# EAGLE design FAL6567e (EAGLE 7.2.0)
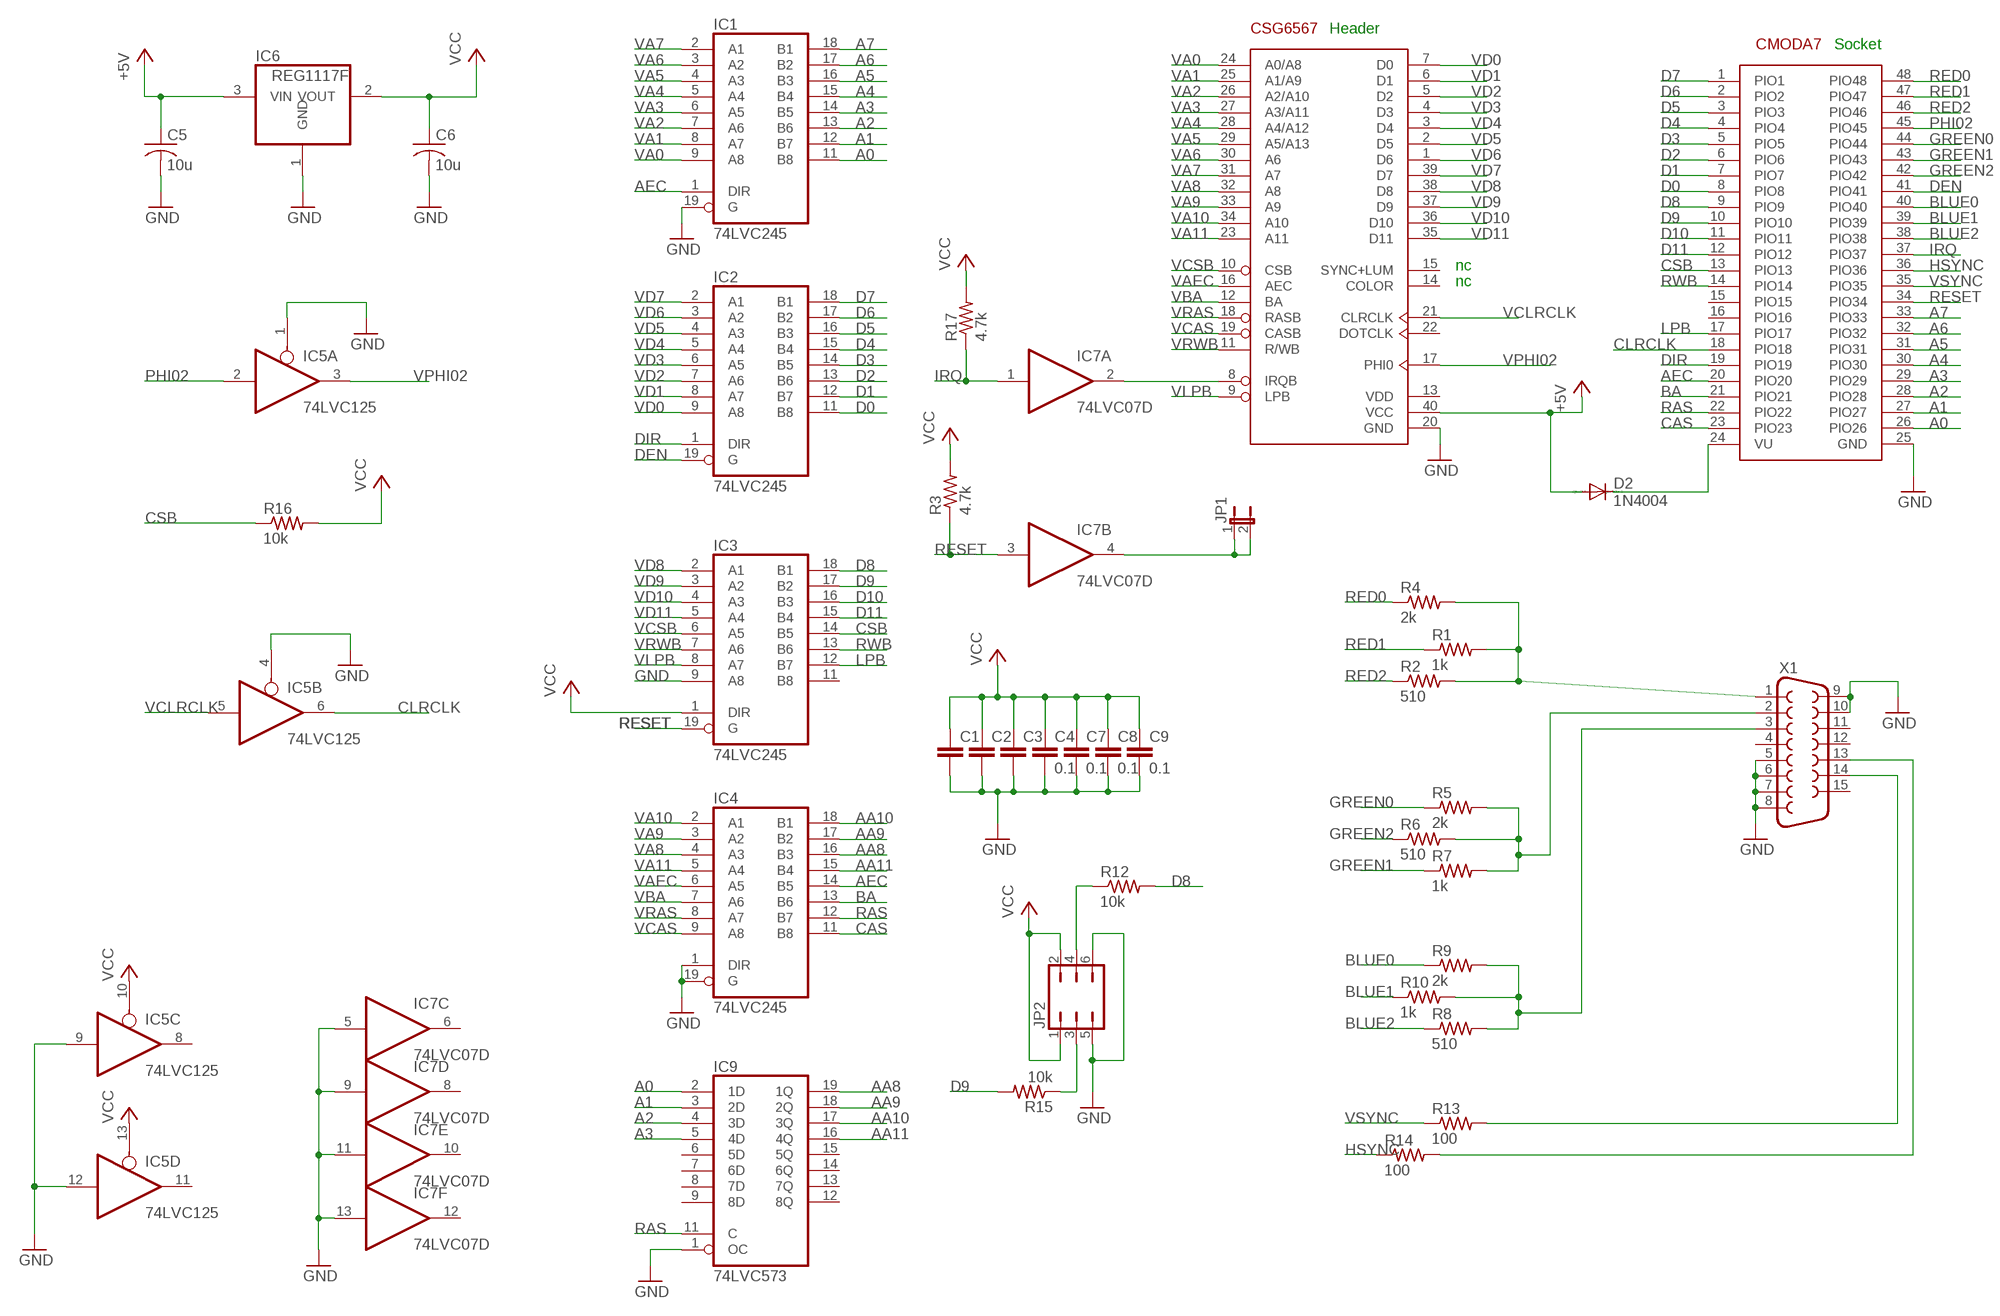
[diagram p0: schematic, sheet 1]

## Parts
C1  C-EU050-024X044  [C050-024X044]
C2  C-EU050-024X044  [C050-024X044]
C3  C-EU050-024X044  [C050-024X044]
C4  0.1  C-EU050-024X044  [C050-024X044]
C5  10u  C-USC1206  [C1206]
C6  10u  C-USC1206  [C1206]
C7  0.1  C-EU050-024X044  [C050-024X044]
C8  0.1  C-EU050-024X044  [C050-024X044]
C9  0.1  C-EU050-024X044  [C050-024X044]
D2  1N4004  [DO41-10]
IC1  74LVC245  74LS245DW  [SO20W]
IC2  74LVC245  74LS245DW  [SO20W]
IC3  74LVC245  74LS245DW  [SO20W]
IC4  74LVC245  74LS245DW  [SO20W]
IC5  74LVC125  [SO14]
IC6  REG1117F  [DD-3]
IC7  74LVC07D  74LS07D  [SO14]
IC9  74LVC573  [SO20W]
JP1  JP1E  [JP1]
JP2  JP3Q  [JP3Q]
R1  1k  R-US_0204/7  [0204/7]
R2  510  R-US_0204/7  [0204/7]
R3  4.7k  R-US_0204/7  [0204/7]
R4  2k  R-US_0204/7  [0204/7]
R5  2k  R-US_0204/7  [0204/7]
R6  510  R-US_0204/7  [0204/7]
R7  1k  R-US_0204/7  [0204/7]
R8  510  R-US_0204/7  [0204/7]
R9  2k  R-US_0204/7  [0204/7]
R10  1k  R-US_0204/7  [0204/7]
R12  10k  R-US_0204/7  [0204/7]
R13  100  R-US_0204/7  [0204/7]
R14  100  R-US_0204/7  [0204/7]
R15  10k  R-US_0204/7  [0204/7]
R16  10k  R-US_0204/7  [0204/7]
R17  4.7k  R-US_0204/7  [0204/7]
U$1  CSG6567  [DIP-40]
U$2  CMODA7  [DIL48]
X1  F15HDV  [HDF15V]

## Nets
+5V: C5.1 D2.A IC6.3(VIN) U$1.40(VCC)
A0: IC1.11(B8) IC9.2(1D) U$2.26(PIO26)
A1: IC1.12(B7) IC9.3(2D) U$2.27(PIO27)
A2: IC1.13(B6) IC9.4(3D) U$2.28(PIO28)
A3: IC1.14(B5) IC9.5(4D) U$2.29(PIO29)
A4: IC1.15(B4) U$2.30(PIO30)
A5: IC1.16(B3) U$2.31(PIO31)
A6: IC1.17(B2) U$2.32(PIO32)
A7: IC1.18(B1) U$2.33(PIO33)
AA8: IC4.16(B3) IC9.19(1Q)
AA9: IC4.17(B2) IC9.18(2Q)
AA10: IC4.18(B1) IC9.17(3Q)
AA11: IC4.15(B4) IC9.16(4Q)
AEC: IC1.1(DIR) IC4.14(B5) U$2.20(PIO20)
BA: IC4.13(B6) U$2.21(PIO21)
BLUE0: R9.1 U$2.40(PIO40)
BLUE1: R10.1 U$2.39(PIO39)
BLUE2: R8.1 U$2.38(PIO38)
CAS: IC4.11(B8) U$2.23(PIO23)
CLRCLK: IC5.6(B:O) U$2.18(PIO18)
CSB: IC3.14(B5) R16.1 U$2.13(PIO13)
D0: IC2.11(B8) U$2.8(PIO8)
D1: IC2.12(B7) U$2.7(PIO7)
D2: IC2.13(B6) U$2.6(PIO6)
D3: IC2.14(B5) U$2.5(PIO5)
D4: IC2.15(B4) U$2.4(PIO4)
D5: IC2.16(B3) U$2.3(PIO3)
D6: IC2.17(B2) U$2.2(PIO2)
D7: IC2.18(B1) U$2.1(PIO1)
D8: IC3.18(B1) R12.2 U$2.9(PIO9)
D9: IC3.17(B2) R15.2 U$2.10(PIO10)
D10: IC3.16(B3) U$2.11(PIO11)
D11: IC3.15(B4) U$2.12(PIO12)
DEN: IC2.19(G) U$2.41(PIO41)
DIR: IC2.1(DIR) U$2.19(PIO19)
GND: C1.2 C2.2 C3.2 C4.2 C5.2 C6.2 C7.2 C8.2 C9.2 IC1.19(G) IC3.9(A8) IC4.1(DIR) IC4.19(G) IC5.1(A:OE) IC5.4(B:OE) IC5.9(C:I) IC5.12(D:I) IC6.1(GND) IC7.5(C:I) IC7.9(D:I) IC7.11(E:I) IC7.13(F:I) IC9.1(OC) JP2.5 JP2.6 U$1.20(GND) U$2.25(GND) X1.5 X1.6 X1.7 X1.8 X1.9 X1.10
GREEN0: R5.1 U$2.44(PIO44)
GREEN1: R7.1 U$2.43(PIO43)
GREEN2: R6.1 U$2.42(PIO42)
HSYNC: R14.1 U$2.36(PIO36)
IRQ: IC7.1(A:I) R17.1 U$2.37(PIO37)
LPB: IC3.12(B7) U$2.17(PIO17)
MD0: JP2.4 R12.1
MD1: JP2.3 R15.1
N$1: IC7.2(A:O) U$1.8(IRQB)
N$4: D2.C U$2.24(VU)
N$7: R1.2 R2.2 R4.2 X1.1
N$8: IC7.4(B:O) JP1.1 JP1.2
N$10: R8.2 R9.2 R10.2 X1.3
N$12: R14.2 X1.13
N$13: R13.2 X1.14
N$15: R5.2 R6.2 R7.2 X1.2
PHI02: IC5.2(A:I) U$2.45(PIO45)
RAS: IC4.12(B7) IC9.11(C) U$2.22(PIO22)
RED0: R4.1 U$2.48(PIO48)
RED1: R1.1 U$2.47(PIO47)
RED2: R2.1 U$2.46(PIO46)
RESET: IC3.19(G) IC7.3(B:I) R3.1 U$2.34(PIO34)
RWB: IC3.13(B6) U$2.14(PIO14)
VA0: IC1.9(A8) U$1.24(A0/A8)
VA1: IC1.8(A7) U$1.25(A1/A9)
VA2: IC1.7(A6) U$1.26(A2/A10)
VA3: IC1.6(A5) U$1.27(A3/A11)
VA4: IC1.5(A4) U$1.28(A4/A12)
VA5: IC1.4(A3) U$1.29(A5/A13)
VA6: IC1.3(A2) U$1.30(A6)
VA7: IC1.2(A1) U$1.31(A7)
VA8: IC4.4(A3) U$1.32(A8)
VA9: IC4.3(A2) U$1.33(A9)
VA10: IC4.2(A1) U$1.34(A10)
VA11: IC4.5(A4) U$1.23(A11)
VAEC: IC4.6(A5) U$1.16(AEC)
VBA: IC4.7(A6) U$1.12(BA)
VCAS: IC4.9(A8) U$1.19(CASB)
VCC: C1.1 C2.1 C3.1 C4.1 C6.1 C7.1 C8.1 C9.1 IC3.1(DIR) IC5.10(C:OE) IC5.13(D:OE) IC6.2(VOUT) JP2.1 JP2.2 R3.2 R16.2 R17.2
VCLRCLK: IC5.5(B:I) U$1.21(CLRCLK)
VCSB: IC3.6(A5) U$1.10(CSB)
VD0: IC2.9(A8) U$1.7(D0)
VD1: IC2.8(A7) U$1.6(D1)
VD2: IC2.7(A6) U$1.5(D2)
VD3: IC2.6(A5) U$1.4(D3)
VD4: IC2.5(A4) U$1.3(D4)
VD5: IC2.4(A3) U$1.2(D5)
VD6: IC2.3(A2) U$1.1(D6)
VD7: IC2.2(A1) U$1.39(D7)
VD8: IC3.2(A1) U$1.38(D8)
VD9: IC3.3(A2) U$1.37(D9)
VD10: IC3.4(A3) U$1.36(D10)
VD11: IC3.5(A4) U$1.35(D11)
VLPB: IC3.8(A7) U$1.9(LPB)
VPHI02: IC5.3(A:O) U$1.17(PHI0)
VRAS: IC4.8(A7) U$1.18(RASB)
VRWB: IC3.7(A6) U$1.11(R/WB)
VSYNC: R13.1 U$2.35(PIO35)
Unconnected: IC3.11(B8) IC5.8(C:O) IC5.11(D:O) IC7.6(C:O) IC7.8(D:O) IC7.10(E:O) IC7.12(F:O) IC9.6(5D) IC9.7(6D) IC9.8(7D) IC9.9(8D) IC9.12(8Q) IC9.13(7Q) IC9.14(6Q) IC9.15(5Q) U$1.14(COLOR) U$1.15(SYNC+LUM) U$1.22(DOTCLK) U$2.15(PIO15) U$2.16(PIO16) X1.4 X1.11 X1.12 X1.15

## Notes on the sheet
- Header
- Socket
- nc
- nc

## Power pins joined to a net without a drawn wire
GND: IC1.10(GND) IC2.10(GND) IC3.10(GND) IC4.10(GND) IC5.7(P:GND) IC7.7(P:GND) IC9.10(GND)
VCC: IC1.20(VCC) IC2.20(VCC) IC3.20(VCC) IC4.20(VCC) IC5.14(P:VCC) IC7.14(P:VCC) IC9.20(VCC)
VDD: U$1.13(VDD)

## Library data of the parts
C1-C4 C7-C9 = resistor:C-EU: CAPACITOR, European symbol
C5 C6 = resistor:C-US: CAPACITOR, American symbol
D2 = diode:1N4004: DIODE general purpose rectifier, 1 A
IC1-IC4 = FT74xx:74*245: Octal BUS TRANSCEIVER, 3-state
IC5 = FT74xx:74*125: Quad bus BUFFER, 3-state
IC6 = burr-brown:REG1117: 800mA and 1A Low Dropout (LDO) Positive Regulator 1.8V, 2.5V, 2.85V, 3.3V, 5V, and Adj; MF: TEXAS INSTRUMENTS; MPN: REG1117FAKTTT; OC_FARNELL: 1296120; OC_NEWARK: 87H2562
IC7 = FT74xx:74*07: Hex BUFFER, open collector high-voltage output
IC9 = FT74xx:74*573: 8-bit D latch BUS DRIVER
JP1 = jumper:JP1E: JUMPER
JP2 = jumper:JP3Q: JUMPER
R1-R10 R12-R17 = resistor:R-US_: RESISTOR, American symbol
U$1 = 65xxx:CSG6567
U$2 = FT74xx:CMODA7
X1 = con-subd:F15: SUB-D; OC_FARNELL: unknown; OC_NEWARK: unknown

## Board
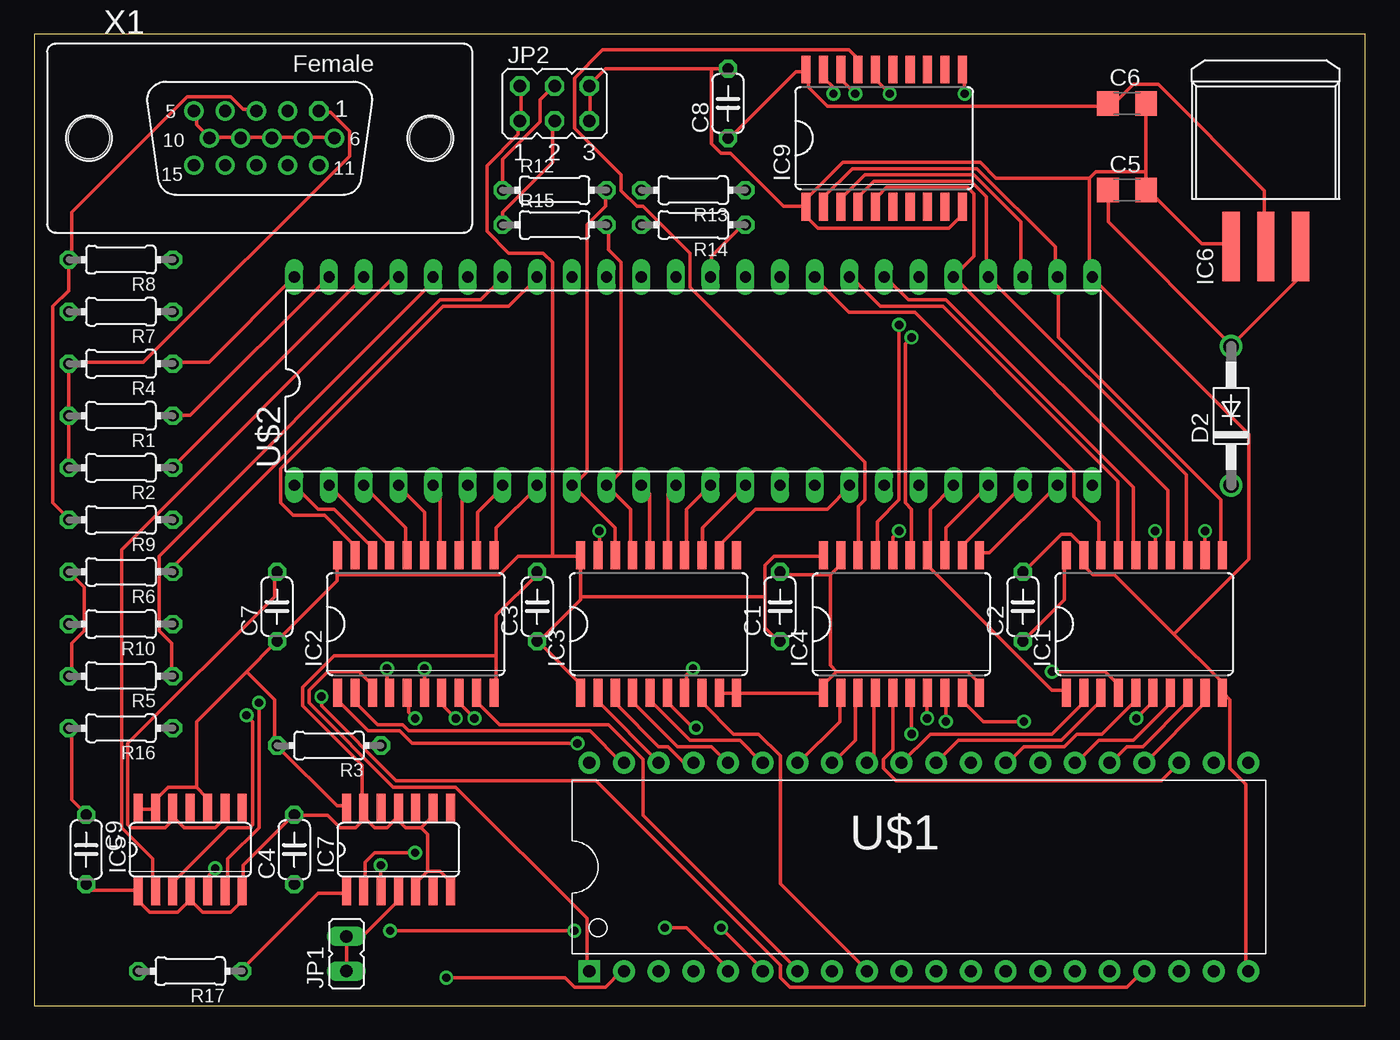
[diagram p1: board, top side]
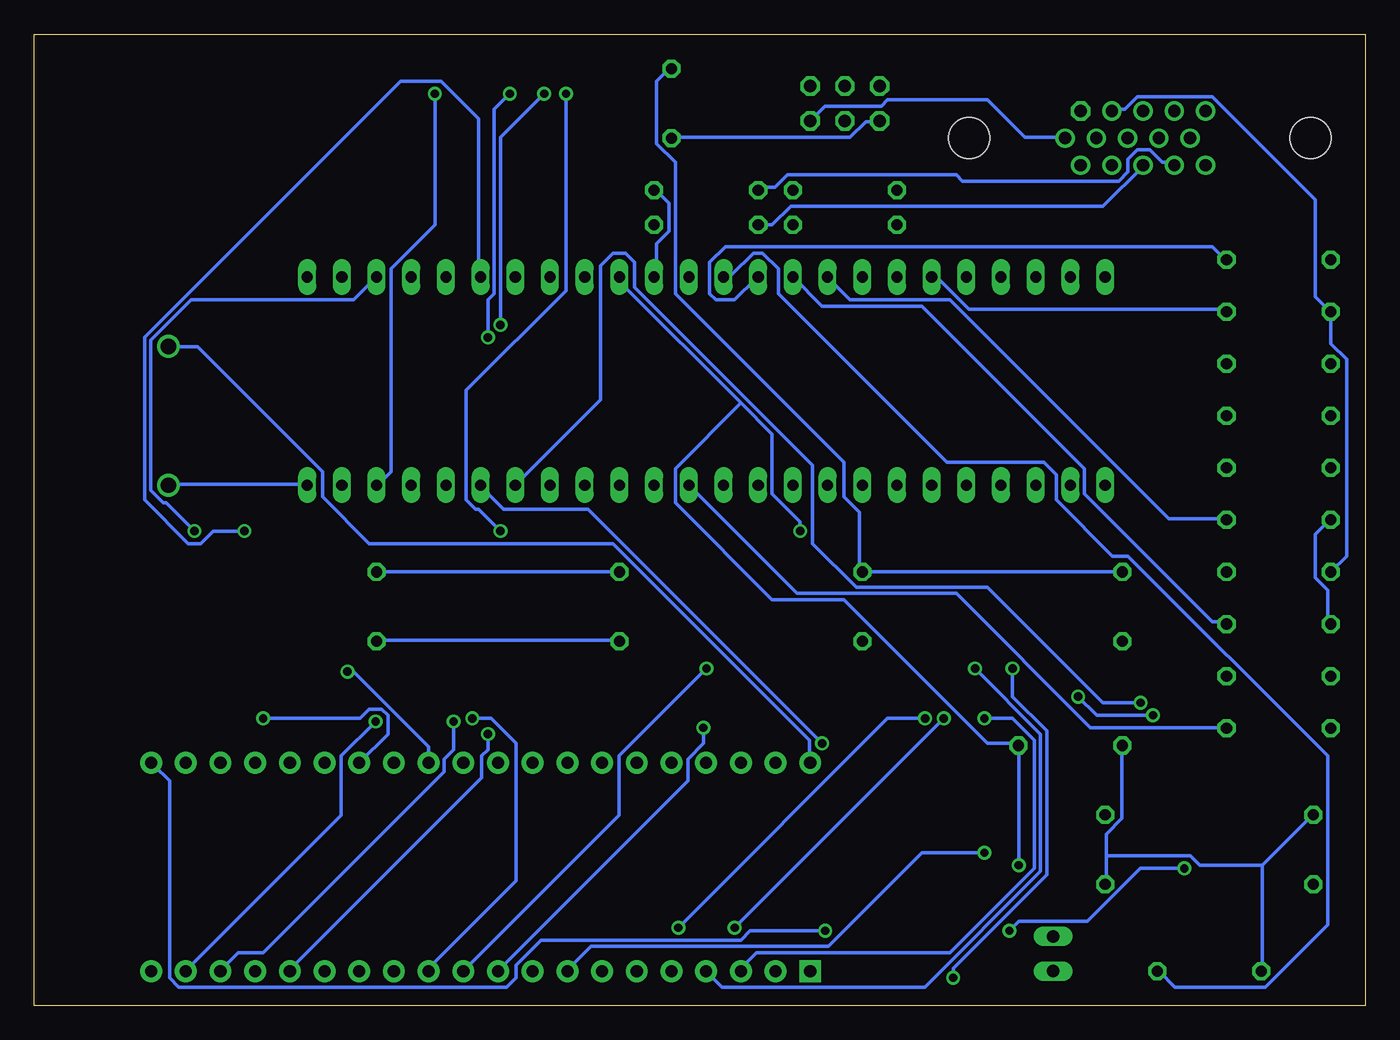
[diagram p2: board, bottom side, seen from below]

Size 97.46 x 71.11 mm. Coordinates in mm from the lower left corner, seen from the top.
Outline: 0,0 97.46,0 97.46,71.11 0,71.11 0,0
Copper layers (1*16): Top 0.035mm / dielectric 1.5mm / Bottom 0.035mm
Design rules "default": minimum track width 10mil, minimum drill 24mil, track to track 8mil, track to pad 8mil, pad to pad 8mil, via to via 8mil, smd to smd 8mil, copper to edge 40mil, drill to drill 8mil, minimum pad ring 10mil, minimum via ring 8mil, stop-mask expansion 4mil, vias tented up to drill 0mil, thermal gap 10mil

### Footprints (pad centres in the part's own frame; a part is rotated, then mirrored left to right if it is on the bottom)
C050-024X044 = drill 0.813 octagon: 1 -2.54,0; 2 2.54,0
C1206 = smd 1.6 x 1.8: 1 -1.4,0; 2 1.4,0
DO41-10 = drill 1.118: A 5.08,0; C -5.08,0
SO20W = smd 0.66 x 2.032: 1 -5.715,-5.029; 2 -4.445,-5.029; 3 -3.175,-5.029; 4 -1.905,-5.029; 5 -0.635,-5.029; 6 0.635,-5.029; 7 1.905,-5.029; 8 3.175,-5.029; 9 4.445,-5.029; 10 5.715,-5.029; 11 5.715,5.029; 12 4.445,5.029; 13 3.175,5.029; 14 1.905,5.029; 15 0.635,5.029; 16 -0.635,5.029; 17 -1.905,5.029; 18 -3.175,5.029; 19 -4.445,5.029; 20 -5.715,5.029
SO14 = smd 0.66 x 2.032: 1 -3.81,-3.073; 2 -2.54,-3.073; 3 -1.27,-3.073; 4 0,-3.073; 5 1.27,-3.073; 6 2.54,-3.073; 7 3.81,-3.073; 8 3.81,3.073; 9 2.54,3.073; 10 1.27,3.073; 11 0,3.073; 12 -1.27,3.073; 13 -2.54,3.073; 14 -3.81,3.073
DD-3 = smd 1.27 x 5.08: 1 -2.54,-7.938; 2 0,-7.938; 3 2.54,-7.938
JP1 = drill 0.914 long: 1 0,-1.27; 2 0,1.27
JP3Q = drill 0.914 octagon: 1 -2.54,-1.27; 2 -2.54,1.27; 3 0,-1.27; 4 0,1.27; 5 2.54,-1.27; 6 2.54,1.27
0204/7 = drill 0.813 octagon: 1 -3.81,0; 2 3.81,0
DIP-40 = drill 0.889 pad 1.6 square: 1 -22.86,-7.62 | drill 0.889 pad 1.6: 2 -20.32,-7.62; 3 -17.78,-7.62; 4 -15.24,-7.62; 5 -12.7,-7.62; 6 -10.16,-7.62; 7 -7.62,-7.62; 8 -5.08,-7.62; 9 -2.54,-7.62; 10 0,-7.62; 11 2.54,-7.62; 12 5.08,-7.62; 13 7.62,-7.62; 14 10.16,-7.62; 15 12.7,-7.62; 16 15.24,-7.62; 17 17.78,-7.62; 18 20.32,-7.62; 19 22.86,-7.62; 20 25.4,-7.62; 21 25.4,7.62; 22 22.86,7.62; 23 20.32,7.62; 24 17.78,7.62; 25 15.24,7.62; 26 12.7,7.62; 27 10.16,7.62; 28 7.62,7.62; 29 5.08,7.62; 30 2.54,7.62; 31 0,7.62; 32 -2.54,7.62; 33 -5.08,7.62; 34 -7.62,7.62; 35 -10.16,7.62; 36 -12.7,7.62; 37 -15.24,7.62; 38 -17.78,7.62; 39 -20.32,7.62; 40 -22.86,7.62
DIL48 = drill 0.813 long: 1 -29.21,-7.62; 2 -26.67,-7.62; 3 -24.13,-7.62; 4 -21.59,-7.62; 5 -19.05,-7.62; 6 -16.51,-7.62; 7 -13.97,-7.62; 8 -11.43,-7.62; 9 -8.89,-7.62; 10 -6.35,-7.62; 11 -3.81,-7.62; 12 -1.27,-7.62; 13 1.27,-7.62; 14 3.81,-7.62; 15 6.35,-7.62; 16 8.89,-7.62; 17 11.43,-7.62; 18 13.97,-7.62; 19 16.51,-7.62; 20 19.05,-7.62; 21 21.59,-7.62; 22 24.13,-7.62; 23 26.67,-7.62; 24 29.21,-7.62; 25 29.21,7.62; 26 26.67,7.62; 27 24.13,7.62; 28 21.59,7.62; 29 19.05,7.62; 30 16.51,7.62; 31 13.97,7.62; 32 11.43,7.62; 33 8.89,7.62; 34 6.35,7.62; 35 3.81,7.62; 36 1.27,7.62; 37 -1.27,7.62; 38 -3.81,7.62; 39 -6.35,7.62; 40 -8.89,7.62; 41 -11.43,7.62; 42 -13.97,7.62; 43 -16.51,7.62; 44 -19.05,7.62; 45 -21.59,7.62; 46 -24.13,7.62; 47 -26.67,7.62; 48 -29.21,7.62
HDF15V = drill 0.9 octagon: 1 4.329,1.98 | drill 0.9: 2 2.043,1.98; 3 -0.243,1.98; 4 -2.529,1.98; 5 -4.815,1.98; 6 5.472,0; 7 3.186,0; 8 0.9,0; 9 -1.386,0; 10 -3.672,0; 11 4.329,-1.98; 12 2.043,-1.98; 13 -0.243,-1.98; 14 -2.529,-1.98; 15 -4.815,-1.98 | hole 3: -12.5,0; 12.5,0

### Placement (x,y rotation side)
C1  54.61,29.21 90 top
C2  72.39,29.21 90 top
C3  36.83,29.21 90 top
C4  19.05,11.43 90 top
C5  80.01,59.69 0 top
C6  80.01,66.04 0 top
C7  17.78,29.21 90 top
C8  50.8,66.04 90 top
C9  3.81,11.43 270 top
D2  87.63,43.18 90 top
IC1  81.28,27.94 0 top
IC2  27.94,27.94 0 top
IC3  45.72,27.94 0 top
IC4  63.5,27.94 0 top
IC5  11.43,11.43 0 top
IC6  90.17,63.5 0 top
IC7  26.67,11.43 0 top
IC9  62.23,63.5 0 top
JP1  22.86,3.81 0 top
JP2  38.1,66.04 0 top
R1  6.35,43.18 180 top
R2  6.35,39.37 180 top
R3  21.59,19.05 180 top
R4  6.35,46.99 180 top
R5  6.35,24.13 180 top
R6  6.35,31.75 180 top
R7  6.35,50.8 180 top
R8  6.35,54.61 180 top
R9  6.35,35.56 180 top
R10  6.35,27.94 180 top
R12  38.1,59.69 0 top
R13  48.26,59.69 180 top
R14  48.26,57.15 180 top
R15  38.1,57.15 0 top
R16  6.35,20.32 180 top
R17  11.43,2.54 180 top
U$1  63.5,10.16 0 top
U$2  48.26,45.72 0 top
X1  16.51,63.5 0 top

### Tracks (layer width: path | path; a pad name or v marks a point on that pad's centre or on a via)
+5V
  Top 0.254: C5.1 78.64,59.66 78.64,57.38 87.55,48.46 D2.A 87.78,48.46 92.58,53.26 92.58,55.55 IC6.3
  Bottom 0.254: U$1.40 40.69,17.83 40.69,19.43 55.09,33.83 72.92,33.83 76.35,37.26 76.35,39.09 85.5,48.23 87.55,48.23 D2.A
A0
  Top 0.254: IC9.2 57.84,58.52 57.84,59.21 59.89,61.27 69.04,61.27 74.75,55.55 74.75,53.49 U$2.26 74.98,53.26 74.98,48.92 86.87,37.03 86.87,33.15 IC1.11
A1  (via drill 0.61)
  Top 0.254: v85.72,34.75 IC1.12 | IC9.3 59.21,58.52 59.21,59.21 60.81,60.81 68.81,60.81 72.24,57.38 72.24,53.49 U$2.27
  Bottom 0.254: v85.72,34.75 87.78,36.8 88.01,36.8 88.92,37.72 88.92,48.69 85.95,51.66 74.07,51.66 U$2.27
A2
  Top 0.254: IC1.13 84.35,33.15 84.35,38.86 69.95,53.26 U$2.28 69.72,53.49 69.72,59.21 68.58,60.35 61.49,60.35 60.35,59.21 60.35,58.52 IC9.4
A3
  Top 0.254: IC9.5 61.72,58.52 61.72,59.21 62.41,59.89 68.35,59.89 68.81,59.44 68.81,54.86 67.44,53.49 U$2.29 67.44,53.26 82.98,37.72 82.98,33.15 IC1.14
A4  (via drill 0.61)
  Top 0.254: v82.07,34.75 82.07,33.15 IC1.15
  Bottom 0.254: v82.07,34.75 84.35,34.75 85.27,33.83 86.18,33.83 89.38,37.03 89.38,48.92 70.64,67.67 67.67,67.67 64.92,64.92 64.92,53.49 U$2.30
A5
  Top 0.254: IC1.16 80.47,33.15 80.47,37.95 66.75,51.66 64.01,51.66 62.41,53.26 U$2.31
A6
  Top 0.254: IC1.17 79.32,33.15 79.32,38.41 66.52,51.21 61.95,51.21 59.89,53.26 U$2.32
A7
  Top 0.254: IC1.18 77.95,33.15 77.95,35.43 76.12,37.26 76.12,39.09 64.47,50.75 59.66,50.75 57.15,53.26 U$2.33
AA8  (via drill 0.61)
  Top 0.254: IC4.16 62.87,34.29 v63.32,34.75 | v58.52,66.75 58.52,67.21 57.84,67.89 57.84,68.35 IC9.19
  Bottom 0.254: v63.32,34.75 64.92,36.35 65.15,36.35 65.84,37.03 65.84,45.03 58.52,52.35 v58.52,66.75
AA9  (via drill 0.61)
  Top 0.254: v63.32,49.84 63.32,37.03 61.72,35.43 61.72,33.15 IC4.17 | v60.12,66.75 59.21,67.67 59.21,68.35 IC9.18
  Bottom 0.254: v63.32,49.84 63.32,63.55 v60.12,66.75
AA10
  Top 0.254: IC4.18 60.35,33.15 60.35,36.58 60.81,37.03 60.81,39.78 48.01,52.58 48.01,55.09 44.58,58.52 44.12,58.52 42.98,59.66 42.98,60.81 39.55,64.24 39.55,67.89 41.6,69.95 59.66,69.95 60.12,69.49 60.12,68.58 IC9.17
AA11  (via drill 0.61)
  Top 0.254: v64.24,48.92 63.78,48.46 63.78,36.8 64.24,36.35 64.24,33.15 IC4.15 | v62.64,66.75 61.72,67.67 61.72,68.35 IC9.16
  Bottom 0.254: v64.24,48.92 64.24,51.66 63.78,52.12 63.78,65.61 v62.64,66.75
AEC
  Top 0.254: U$2.20 67.21,37.95 65.61,36.35 65.61,33.15 IC4.14 65.61,32.92 65.61,32 74.52,23.09 75.44,23.09 IC1.1
BA
  Top 0.254: IC4.13 66.75,33.15 66.75,34.98 69.72,37.95 U$2.21
BLUE0
  Bottom 0.254: R9.1 10.29,35.66 14.4,35.66 30.4,51.66 37.72,51.66 39.32,53.26 U$2.40
BLUE1
  Bottom 0.254: U$2.39 39.78,51.21 32.46,51.21 20.57,39.32 20.57,37.49 11.2,28.12 10.29,28.12 R10.1
BLUE2
  Bottom 0.254: U$2.38 44.58,53.26 46.18,51.66 47.55,51.66 48.01,52.12 48.01,54.41 46.86,55.55 11.2,55.55 10.29,54.63 R8.1
CAS
  Top 0.254: IC4.11 69.27,33.15 69.95,33.15 74.75,37.95 U$2.23
CLRCLK  (via drill 0.61)
  Top 0.254: v16.46,22.17 16.46,13.03 14.17,10.74 14.17,8.46 IC5.6
  Bottom 0.254: v16.46,22.17 19.2,22.17 27.66,30.63 37.26,30.63 40.46,33.83 40.46,39.55 53.49,52.58 53.49,54.41 54.18,55.09 55.09,55.09 56.01,54.18 56.01,44.35 62.18,38.18 U$2.18
CSB
  Top 0.254: U$2.13 47.78,36.35 47.78,33.15 IC3.14
  Bottom 0.254: U$2.13 41.6,30.18 29.95,30.18 20.12,20.34 10.29,20.34 R16.1
D0
  Top 0.254: IC2.11 33.83,33.15 33.83,34.98 36.8,37.95 U$2.8
D1
  Top 0.254: IC2.12 32.46,33.15 32.46,36.12 34.29,37.95 U$2.7
D2
  Top 0.254: IC2.13 31.32,33.15 31.32,37.72 31.55,37.95 U$2.6
D3
  Top 0.254: IC2.14 29.72,33.15 29.72,37.49 29.26,37.95 U$2.5
D4
  Top 0.254: IC2.15 28.57,36.12 26.75,37.95 U$2.4
D5
  Top 0.254: IC2.16 27.2,33.15 27.2,34.98 24.23,37.95 U$2.3
D6
  Top 0.254: IC2.17 25.83,33.15 25.83,33.83 21.72,37.95 U$2.2
D7
  Top 0.254: U$2.1 20.8,36.35 21.95,36.35 24.69,33.6 24.69,33.15 IC2.18
D8
  Top 0.254: IC3.18 42.52,33.15 42.52,34.98 39.55,37.95 U$2.9 39.55,38.18 40.46,39.09 40.46,57.15 41.83,58.52 41.83,59.66 R12.2
D9
  Top 0.254: IC3.17 43.66,33.15 43.66,36.35 U$2.10 42.06,38.18 42.98,39.09 42.98,54.41 42.06,55.32 42.06,57.15 R15.2
D10
  Top 0.254: IC3.16 45.03,33.15 45.03,37.49 44.58,37.95 U$2.11
D11
  Top 0.254: IC3.15 46.41,33.15 46.41,37.49 46.86,37.95 U$2.12
DEN
  Top 0.254: IC2.19 23.32,33.15 23.32,33.83 21.26,35.89 18.97,35.89 18.06,36.8 18.06,39.32 29.95,51.21 34.75,51.21 36.8,53.26 U$2.41
DIR  (via drill 0.61)
  Top 0.254: v39.78,19.2 27.66,19.2 26.75,20.12 24.46,20.12 22.4,22.17 22.4,22.86 IC2.1
  Bottom 0.254: v39.78,19.2 56.92,36.35 63.09,36.35 64.69,37.95 U$2.19
GND
  Top 0.254: 58.29,31.55 58.98,32.23 58.98,32.92 IC4.19 | 58.29,31.55 54.63,31.55 C1.2 | 51.44,22.86 50.29,22.86 IC3.9 | 51.44,22.86 57.61,22.86 IC4.1 57.84,23.09 57.84,23.55 58.75,24.46 | 51.44,22.86 IC3.10 | 58.75,24.46 68.35,24.46 69.04,23.77 69.04,23.09 IC4.10 | 58.29,31.55 58.29,24.92 58.75,24.46 | C2.2 72.47,31.77 75.21,34.52 75.89,34.52 76.81,33.6 76.81,33.15 IC1.19 77.04,32.92 77.04,32 77.5,31.55 79.1,31.55 83.44,27.2 | 83.44,27.2 86.87,23.77 86.87,23.09 IC1.10 87.1,22.86 87.55,22.4 87.55,17.37 88.7,16.23 88.7,2.74 U$1.20 | C9.2 3.89,8.69 4.12,8.46 7.54,8.46 IC5.1 7.77,8.23 7.77,7.54 8.46,6.86 10.52,6.86 11.43,7.77 | 11.43,7.77 IC5.4 11.43,8.23 | 11.43,7.77 12.34,6.86 14.4,6.86 15.09,7.54 15.09,8.23 IC5.7 15.32,8.46 15.32,10.29 18.97,13.95 C4.2 19.2,13.95 21.49,13.95 22.4,13.03 23.55,13.03 24.23,13.72 | 28.8,9.83 28.12,9.14 28.12,8.46 IC7.5 | 28.8,9.83 29.72,9.83 30.4,9.14 30.4,8.46 IC7.7 | 24.23,13.72 24.23,14.4 IC7.13 | 24.23,13.72 24.92,13.03 25.83,13.03 26.52,13.72 | 26.52,13.72 26.52,14.4 IC7.11 26.52,13.72 | 28.35,13.03 29.03,13.72 29.03,14.4 IC7.9 | 28.35,13.03 27.2,13.03 26.52,13.72 | 24.23,13.72 IC7.13 | 28.8,9.83 28.8,12.57 28.35,13.03 | 10.29,13.72 10.29,14.4 IC5.12 10.29,13.72 | 10.29,13.72 10.97,13.03 13.26,13.03 13.95,13.72 13.95,14.4 IC5.9 | 33.83,25.6 33.83,28.57 36.8,31.55 C3.2 | 33.83,25.6 33.83,23.09 IC2.10 | 10.29,13.72 9.6,13.03 7.09,13.03 6.86,13.26 6.86,19.2 17.6,29.95 17.6,31.55 C7.2 | 33.83,25.6 21.95,25.6 19.66,23.32 19.66,21.95 24,17.6 24,14.63 IC7.13 | 81.38,61.04 81.38,65.84 C6.2 | 81.38,61.04 81.38,59.89 C5.2 81.61,59.66 85.5,55.78 87.55,55.78 IC6.1
  Top 0.254: 77.27,60.58 77.27,53.49 U$2.25 77.5,53.26 88.92,41.83 88.92,32.69 83.44,27.2 | 77.27,60.58 77.72,61.04 81.38,61.04 | X1.6 21.95,63.55 19.89,63.55 X1.7 19.66,63.55 17.6,63.55 X1.8 17.37,63.55 15.32,63.55 X1.9 15.09,63.55 13.03,63.55 X1.10 12.8,63.55 11.89,64.47 11.89,65.38 X1.5 | IC9.1 56.69,58.29 56.69,57.61 57.38,56.92 66.98,56.92 67.89,57.84 67.89,58.29 IC9.10 | 49.61,68.58 41.83,68.58 40.69,67.44 JP2.6 40.69,67.21 40.69,64.92 JP2.5 | 49.61,68.58 C8.2 | 49.61,68.58 49.61,63.09 50.29,62.41 50.98,62.41 54.86,58.52 56.46,58.52 IC9.1 | 77.27,60.58 70.41,60.58 69.27,61.72 59.21,61.72 56.69,59.21 56.69,58.52 IC9.1
  Bottom 0.254: C1.2 54.63,31.77 72.24,31.77 C2.2 | C7.2 17.83,31.77 36.8,31.77 C3.2 37.03,31.77 37.03,36.12 38.18,37.26 38.18,39.78 50.52,52.12 50.52,61.72 51.89,63.09 51.89,67.67 50.98,68.58 C8.2 | X1.6 22.17,63.55 24.92,63.55 27.66,66.29 34.98,66.29 35.43,65.84 39.55,65.84 40.46,64.92 JP2.5
GREEN0
  Top 0.254: R5.1 10.06,24.23 10.06,26.52 9.14,27.43 9.14,32.92 29.03,52.81 29.03,53.26 U$2.44
GREEN1
  Bottom 0.254: R7.1 10.29,50.98 29.03,50.98 31.55,53.49 U$2.43
GREEN2
  Top 0.254: R6.1 10.29,31.77 10.29,32.23 29.72,51.66 32.69,51.66 34.29,53.26 U$2.42
HSYNC
  Top 0.254: U$2.36 49.61,53.49 49.61,54.86 51.89,57.15 R14.1
IRQ
  Top 0.254: IC7.1 22.86,8.23 20.8,8.23 15.32,2.74 R17.1
  Bottom 0.254: U$2.37 46.86,53.49 46.41,53.49 44.81,55.09 44.12,55.09 42.98,53.95 42.98,52.12 30.63,39.78 23.55,39.78 22.63,38.86 22.63,37.03 18.52,32.92 17.37,32.92 2.74,18.29 2.74,5.94 7.32,1.37 13.95,1.37 15.09,2.52 R17.1
LPB
  Top 0.254: IC3.12 50.29,33.15 50.29,33.83 52.81,36.35 58.06,36.35 59.66,37.95 U$2.17
MD0
  Top 0.254: R12.1 34.29,61.95 37.03,64.69 37.03,66.29 37.95,67.21 JP2.4
MD1
  Top 0.254: R15.1 34.29,58.06 37.95,61.72 37.95,64.69 JP2.3
N$1  (via drill 0.61)
  Top 0.254: v27.89,11.2 24.92,11.2 24.23,10.52 24.23,8.46 IC7.2
  Bottom 0.254: v27.89,11.2 32.46,11.2 39.32,4.34 56.69,4.34 58.29,2.74 U$1.8
N$4
  Bottom 0.254: U$2.24 77.5,38.18 87.55,38.18 D2.C
N$7
  Top 0.254: R2.2 2.52,39.55 2.52,42.98 R1.2 2.52,43.2 2.52,46.86 R4.2 2.74,47.09 8,47.09 23.09,62.18 23.09,64.01 21.72,65.38 21.03,65.38 X1.1
N$8
  Top 0.254: IC7.4 26.52,8.23 26.52,7.54 24.23,5.26 22.86,5.26 JP1.2 JP1.1
N$10
  Top 0.254: R9.2 2.52,35.66 1.37,36.8 1.37,51.21 2.52,52.35 2.52,54.41 R8.2 2.74,54.63 2.74,58.06 11.2,66.52 14.4,66.52 15.32,65.61 16.23,65.61 X1.3
  Bottom 0.254: R10.2 2.74,28.12 2.74,30.4 3.66,31.32 3.66,34.52 2.74,35.43 R9.2
N$12
  Bottom 0.254: R14.2 43.43,57.15 42.06,58.52 19.2,58.52 16.23,61.49 X1.13
N$13
  Bottom 0.254: R13.2 44.35,59.89 43.2,59.89 42.29,60.81 29.95,60.81 29.49,60.35 18.06,60.35 17.37,61.04 17.37,61.95 16.69,62.64 15.77,62.64 14.86,61.72 14.17,61.72 X1.14
N$15
  Top 0.254: R6.2 3.66,30.63 3.66,27.43 2.74,26.52 2.74,24.23 R5.2
  Bottom 0.254: R6.2 1.37,32.92 1.37,47.32 2.52,48.46 2.52,50.75 R7.2 2.74,50.98 3.66,51.89 3.66,58.98 11.2,66.52 16.69,66.52 17.6,65.61 18.52,65.61 X1.2
PHI02
  Top 0.254: IC5.2 8.69,8.46 8.69,10.74 6.4,13.03 6.4,33.38 26.52,53.49 U$2.45
RAS  (via drill 0.61)
  Top 0.254: U$2.22 68.12,33.83 68.12,33.15 IC4.12 | v68.12,66.75 68.12,68.35 IC9.11
  Bottom 0.254: v68.12,66.75 68.12,57.15 71.32,53.95 71.32,39.09 72.24,38.18 U$2.22
RED0
  Top 0.254: U$2.48 12.8,47.09 10.29,47.09 R4.1
RED1
  Top 0.254: R1.1 10.29,43.2 11.43,43.2 21.49,53.26 U$2.47
RED2
  Top 0.254: R2.1 10.29,39.55 24,53.26 U$2.46
RESET  (via drill 0.61)
  Top 0.254: v25.38,10.29 25.38,8.46 IC7.3 | v41.38,34.75 41.38,33.15 IC3.19
  Bottom 0.254: v25.38,10.29 25.38,18.97 R3.1 25.6,19.2 27.66,19.2 38.18,29.72 43.43,29.72 50.52,36.8 50.52,39.32 45.72,44.12 | v41.38,34.75 41.38,35.43 43.43,37.49 43.43,41.83 45.72,44.12 | 45.72,44.12 54.41,52.81 54.41,53.26 U$2.34
RWB
  Top 0.254: IC3.13 48.92,33.15 48.92,34.98 51.89,37.95 U$2.14
VA0
  Top 0.254: IC1.9 85.72,22.17 81.38,17.83 U$1.24
VA1
  Top 0.254: IC1.8 84.35,22.86 84.35,22.17 81.15,18.97 80.01,18.97 78.87,17.83 U$1.25
VA2
  Top 0.254: IC1.7 82.98,22.86 82.98,21.95 80.47,19.43 77.95,19.43 76.35,17.83 U$1.26
VA3  (via drill 0.61)
  Top 0.254: v80.7,21.03 81.84,22.17 81.84,22.86 IC1.6
  Bottom 0.254: v80.7,21.03 73.61,21.03 72.92,21.72 72.01,21.72 71.55,21.26 71.55,19.89 U$1.27
VA4
  Top 0.254: IC1.5 80.47,22.86 80.47,22.17 78.18,19.89 76.35,19.89 75.44,18.97 72.47,18.97 71.32,17.83 U$1.28
VA5  (via drill 0.61)
  Top 0.254: v74.52,24.46 78.41,24.46 79.32,23.55 79.32,23.09 IC1.4
  Bottom 0.254: v74.52,24.46 74.07,24.46 68.58,18.97 U$1.29
VA6
  Top 0.254: IC1.3 77.95,22.86 77.95,22.17 75.21,19.43 67.67,19.43 66.06,17.83 U$1.30
VA7
  Top 0.254: U$1.31 65.61,19.89 74.52,19.89 76.81,22.17 76.81,22.86 IC1.2
VA8
  Top 0.254: IC4.4 61.49,22.86 61.49,18.29 61.04,17.83 U$1.32
VA9
  Top 0.254: IC4.3 60.12,22.86 60.12,19.43 58.52,17.83 U$1.33
VA10
  Top 0.254: IC4.2 58.98,22.86 58.98,20.8 56.01,17.83 U$1.34
VA11
  Top 0.254: IC4.5 62.87,18.75 62.18,18.06 62.18,17.37 63.09,16.46 82.53,16.46 83.67,17.6 U$1.23
VAEC  (via drill 0.61)
  Top 0.254: v64.24,19.89 64.24,22.86 IC4.6
  Bottom 0.254: v64.24,19.89 64.24,18.75 64.69,18.29 64.69,16.69 78.64,2.74 U$1.16
VBA  (via drill 0.61)
  Top 0.254: v65.38,21.03 65.38,22.86 IC4.7
  Bottom 0.254: v65.38,21.03 64.01,21.03 62.18,19.2 62.18,9.14 68.58,2.74 U$1.12
VCAS  (via drill 0.61)
  Top 0.254: v72.47,20.8 69.49,20.8 68.12,22.17 68.12,22.86 IC4.9
  Bottom 0.254: v72.47,20.8 74.98,18.29 74.98,13.95 86.18,2.74 U$1.19
VCC
  Top 0.254: IC6.2 90.07,55.78 90.07,59.66 82.3,67.44 80.47,67.44 79.1,66.06 78.64,66.06 C6.1 78.41,65.84 58.06,65.84 56.69,67.21 56.69,68.35 IC9.20 56.46,68.35 55.78,68.35 50.98,63.55 C8.1 | JP2.2 35.66,67.21 35.66,64.92 JP2.1 35.43,64.69 35.43,63.78 33.15,61.49 33.15,56.69 34.75,55.09 37.26,55.09 37.95,54.41 37.95,32.92 | C2.1 75.44,29.72 75.44,32.92 IC1.20 | 53.49,29.95 53.49,27.66 54.41,26.75 C1.1 | 53.49,29.95 53.49,32.23 54.18,32.92 57.61,32.92 IC4.20 | IC3.1 40.01,23.55 37.03,26.52 C3.1 37.03,26.75 40.01,29.72 40.01,29.95 | 40.01,29.95 40.01,32.92 | 40.01,29.95 53.49,29.95 | R16.2 2.74,20.12 2.74,15.09 3.66,14.17 C9.1 | IC7.14 22.86,14.63 22.17,14.63 17.83,18.97 R3.2 17.6,19.2 17.6,22.4 15.54,24.46 | IC5.14 7.77,14.4 8.69,14.4 IC5.13 8.91,14.63 8.91,15.09 9.83,16 11.89,16 | 11.89,16 12.57,15.32 12.57,14.63 IC5.10 | 22.17,31.55 22.17,31.09 17.83,26.75 C7.1 17.6,26.52 15.54,24.46 | 22.17,31.55 22.17,32.92 IC2.20 | 11.89,16 11.89,20.8 15.54,24.46 | 37.95,32.92 35.43,32.92 34.06,31.55 22.17,31.55 | 37.95,32.92 40.01,32.92 | 40.01,32.92 IC3.20
  Bottom 0.254: JP2.1 35.66,64.69 36.58,64.69 37.72,63.55 50.75,63.55 C8.1 | C2.1 72.24,26.75 54.63,26.75 C1.1 | 7.54,10.29 7.54,2.74 R17.2 | 7.54,10.29 3.89,13.95 C9.1 | 18.97,10.97 18.97,12.57 17.83,13.72 17.83,18.97 R3.2 | 18.97,10.97 18.97,8.91 C4.1 | 7.54,10.29 12.12,10.29 12.8,10.97 18.97,10.97
VCLRCLK  (via drill 0.61)
  Top 0.254: v13.26,10.06 12.8,9.6 12.8,8.46 IC5.5 | v39.55,5.49 v26.06,5.49
  Bottom 0.254: v13.26,10.06 16.46,10.06 20.34,6.17 25.38,6.17 v26.06,5.49 | v39.55,5.49 45.03,5.49 45.72,4.8 60.35,4.8 62.18,2.97 62.18,2.06 62.87,1.37 86.87,1.37 87.55,2.06 87.55,16.46 88.7,17.6 U$1.21
VCSB  (via drill 0.61)
  Top 0.254: v48.46,20.34 48.23,20.34 46.41,22.17 46.41,22.86 IC3.6
  Bottom 0.254: v48.46,20.34 48.46,19.2 49.61,18.06 49.61,16.46 63.32,2.74 U$1.10
VD0
  Top 0.254: IC2.9 32.46,22.86 32.46,22.17 34.06,20.57 42.06,20.57 44.58,18.06 44.58,13.95 55.78,2.74 U$1.7
VD1  (via drill 0.61)
  Top 0.254: v32.23,21.03 31.32,21.95 31.32,22.86 IC2.8 | v50.29,5.71 53.26,2.74 U$1.6
  Bottom 0.254: v32.23,21.03 34.98,21.03 v50.29,5.71
VD2  (via drill 0.61)
  Top 0.254: v30.86,21.03 29.95,21.95 29.95,22.86 IC2.7 | v46.18,5.71 47.78,5.71 50.75,2.74 U$1.5
  Bottom 0.254: v46.18,5.71 v30.86,21.03
VD3  (via drill 0.61)
  Top 0.254: v28.57,24.69 IC2.6
  Bottom 0.254: v28.57,24.69 23.77,19.89 23.77,9.83 32.23,1.37 47.09,1.37 U$1.4
VD4  (via drill 0.61)
  Top 0.254: v27.89,21.03 27.43,21.49 27.43,22.86 IC2.5
  Bottom 0.254: v27.89,21.03 25.83,21.03 24.23,19.43 24.23,10.06 30.4,3.89 44.58,3.89 45.72,2.74 U$1.3
VD5  (via drill 0.61)
  Top 0.254: v25.83,24.69 25.83,23.09 IC2.4 | v30.18,2.06 38.86,2.06 39.55,1.37 41.83,1.37 42.98,2.52 U$1.2
  Bottom 0.254: v25.83,24.69 25.83,22.63 23.32,20.12 23.32,9.6 30.18,2.74 v30.18,2.06
VD6
  Top 0.254: IC2.3 24.69,23.09 24.69,23.55 23.77,24.46 21.49,24.46 20.12,23.09 20.12,22.17 26.29,16 30.86,16 40.46,6.4 40.46,2.74 U$1.1
VD7
  Top 0.254: IC2.2 23.55,22.86 23.55,22.17 25.15,20.57 26.98,20.57 27.43,20.12 40.69,20.12 42.98,17.83 U$1.39
VD8
  Top 0.254: IC3.2 41.38,22.86 41.38,22.17 45.72,17.83 U$1.38
VD9
  Top 0.254: IC3.3 42.75,22.86 42.75,21.95 45.72,18.97 46.41,18.97 47.55,17.83 48.23,17.83 U$1.37
VD10
  Top 0.254: U$1.36 49.61,18.97 47.09,18.97 43.89,22.17 43.89,22.86 IC3.4
VD11
  Top 0.254: IC3.5 45.26,22.86 45.26,22.17 48.01,19.43 51.66,19.43 53.26,17.83 U$1.35
VLPB
  Top 0.254: IC3.8 48.92,22.86 48.92,22.17 51.21,19.89 53.03,19.89 54.63,18.29 54.63,8.91 60.81,2.74 U$1.9
VPHI02  (via drill 0.61)
  Top 0.254: v15.54,21.26 16,20.8 16,13.26 15.77,13.03 14.17,13.03 10.29,9.14 10.29,8.46 IC5.3 | v21.03,22.63 21.03,21.95 26.52,16.46 41.15,16.46 54.63,2.97 54.63,2.06 55.32,1.37 80.01,1.37 81.15,2.52 U$1.17
  Bottom 0.254: v15.54,21.26 19.66,21.26 v21.03,22.63
VRAS  (via drill 0.61)
  Top 0.254: v66.75,20.8 66.75,22.86 IC4.8
  Bottom 0.254: v66.75,20.8 66.75,18.75 67.44,18.06 67.44,17.14 80.7,3.89 82.53,3.89 83.67,2.74 U$1.18
VRWB  (via drill 0.61)
  Top 0.254: v48.23,24.69 47.78,24.23 47.78,23.09 IC3.7
  Bottom 0.254: v48.23,24.69 54.63,18.29 54.63,13.95 U$1.11
VSYNC
  Bottom 0.254: U$2.35 51.89,53.49 51.89,55.78 50.98,56.69 50.98,58.75 51.89,59.66 R13.1